# Altium schematic sheet Keys.SchDoc
size A4
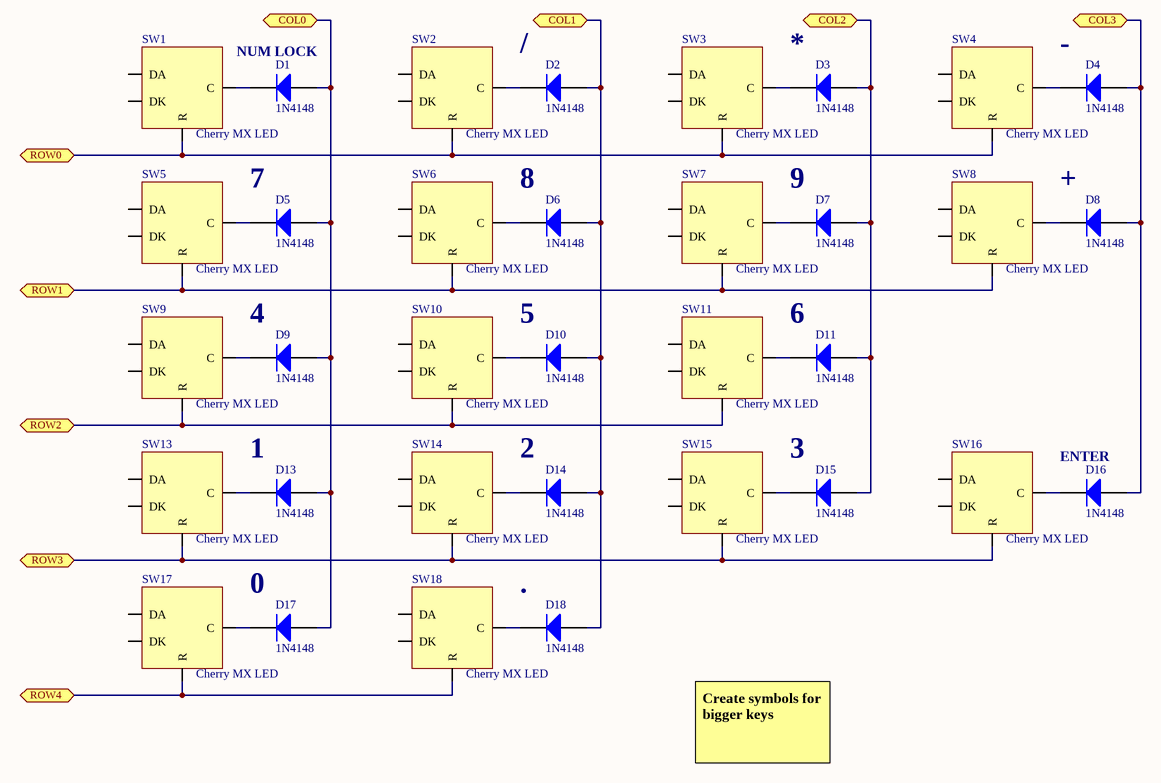
[diagram p0: Keys.SchDoc]

## Parts
D1  1N4148  [NXP-SOD27-2_V]
D2  1N4148  [NXP-SOD27-2_V]
D3  1N4148  [NXP-SOD27-2_V]
D4  1N4148  [NXP-SOD27-2_V]
D5  1N4148  [NXP-SOD27-2_V]
D6  1N4148  [NXP-SOD27-2_V]
D7  1N4148  [NXP-SOD27-2_V]
D8  1N4148  [NXP-SOD27-2_V]
D9  1N4148  [NXP-SOD27-2_V]
D10  1N4148  [NXP-SOD27-2_V]
D11  1N4148  [NXP-SOD27-2_V]
D13  1N4148  [NXP-SOD27-2_V]
D14  1N4148  [NXP-SOD27-2_V]
D15  1N4148  [NXP-SOD27-2_V]
D16  1N4148  [NXP-SOD27-2_V]
D17  1N4148  [NXP-SOD27-2_V]
D18  1N4148  [NXP-SOD27-2_V]
SW1  Cherry MX LED  [Cherry MX LED]
SW2  Cherry MX LED  [Cherry MX LED]
SW3  Cherry MX LED  [Cherry MX LED]
SW4  Cherry MX LED  [Cherry MX LED]
SW5  Cherry MX LED  [Cherry MX LED]
SW6  Cherry MX LED  [Cherry MX LED]
SW7  Cherry MX LED  [Cherry MX LED]
SW8  Cherry MX LED  [Cherry MX LED]
SW9  Cherry MX LED  [Cherry MX LED]
SW10  Cherry MX LED  [Cherry MX LED]
SW11  Cherry MX LED  [Cherry MX LED]
SW13  Cherry MX LED  [Cherry MX LED]
SW14  Cherry MX LED  [Cherry MX LED]
SW15  Cherry MX LED  [Cherry MX LED]
SW16  Cherry MX LED  [Cherry MX LED]
SW17  Cherry MX LED  [Cherry MX LED]
SW18  Cherry MX LED  [Cherry MX LED]

## Ports
COL0 (bidir), COL1 (bidir), COL2 (bidir), COL3 (bidir), ROW0 (bidir), ROW1 (bidir), ROW2 (bidir), ROW3 (bidir), ROW4 (bidir)

## Nets
COL0: D1.1(A) D5.1(A) D9.1(A) D13.1(A) D17.1(A) ; port COL0
COL1: D2.1(A) D6.1(A) D10.1(A) D14.1(A) D18.1(A) ; port COL1
COL2: D3.1(A) D7.1(A) D11.1(A) D15.1(A) ; port COL2
COL3: D4.1(A) D8.1(A) D16.1(A) ; port COL3
ROW0: SW1.1(R) SW2.1(R) SW3.1(R) SW4.1(R) ; port ROW0
ROW1: SW5.1(R) SW6.1(R) SW7.1(R) SW8.1(R) ; port ROW1
ROW2: SW9.1(R) SW10.1(R) SW11.1(R) ; port ROW2
ROW3: SW13.1(R) SW14.1(R) SW15.1(R) SW16.1(R) ; port ROW3
ROW4: SW17.1(R) SW18.1(R) ; port ROW4
NetD1_2: D1.2(K) SW1.2(C)
NetD2_2: D2.2(K) SW2.2(C)
NetD3_2: D3.2(K) SW3.2(C)
NetD4_2: D4.2(K) SW4.2(C)
NetD5_2: D5.2(K) SW5.2(C)
NetD6_2: D6.2(K) SW6.2(C)
NetD7_2: D7.2(K) SW7.2(C)
NetD8_2: D8.2(K) SW8.2(C)
NetD9_2: D9.2(K) SW9.2(C)
NetD10_2: D10.2(K) SW10.2(C)
NetD11_2: D11.2(K) SW11.2(C)
NetD13_2: D13.2(K) SW13.2(C)
NetD14_2: D14.2(K) SW14.2(C)
NetD15_2: D15.2(K) SW15.2(C)
NetD16_2: D16.2(K) SW16.2(C)
NetD17_2: D17.2(K) SW17.2(C)
NetD18_2: D18.2(K) SW18.2(C)

Not connected (* = marked no-connect by the designer): SW1 3(DA) 4(DK); SW2 3(DA) 4(DK); SW3 3(DA) 4(DK); SW4 3(DA) 4(DK); SW5 3(DA) 4(DK); SW6 3(DA) 4(DK); SW7 3(DA) 4(DK); SW8 3(DA) 4(DK); SW9 3(DA) 4(DK); SW10 3(DA) 4(DK); SW11 3(DA) 4(DK); SW13 3(DA) 4(DK); SW14 3(DA) 4(DK); SW15 3(DA) 4(DK); SW16 3(DA) 4(DK); SW17 3(DA) 4(DK); SW18 3(DA) 4(DK)

## Notes on the sheet
- NUM LOCK
- /
- *
- -
- 7
- 8
- 9
- +
- 4
- 5
- 6
- 1
- 2
- 3
- ENTER
- 0
- .
- Create symbols for bigger keys

## Library data of the parts
D1-D11 D13-D18 = CMP-0648-00002-1: High-speed Diode, 100 V, 450 mA, 2-Pin SOD27, RoHS; Manufacturer: NXP Semiconductors; Configuration: Single; IR (VR: 20 V)=25 nA; IFRM: 450 mA; IFSM: 4 A Max.; Trr: 4 ns Max.; Cd: 4 pF Max.; VR: 100 V Max.; VF (IF: 10 mA)=1 V; IF: 200 mA Max.; ComponentLink1Description: Manufacturer URL; RoHS: TRUE; ComponentLink1URL: http://www.nxp.com/; ComponentLink3Description: Package Specification; DatasheetVersion: Aug-04; ComponentLink2Description: Datasheet; PackageVersion: Aug-04; PackageReference: SOD27; ComponentLink3URL: http://www.nxp.com/documents/data_sheet/1N4148_1N4448.pdf; Mounting Technology: Through Hole; ComponentLink2URL: http://www.nxp.com/documents/data_sheet/1N4148_1N4448.pdf; PartNumber: 1N4148; PackageDescription: 2-Pin Hermetically Sealed Glass Package, Axial Leaded, Dia 1.85 mm, Body Length 4.25 mm, Lead Spread 25.4 mm